# Altium schematic sheet communication.SchDoc
size A
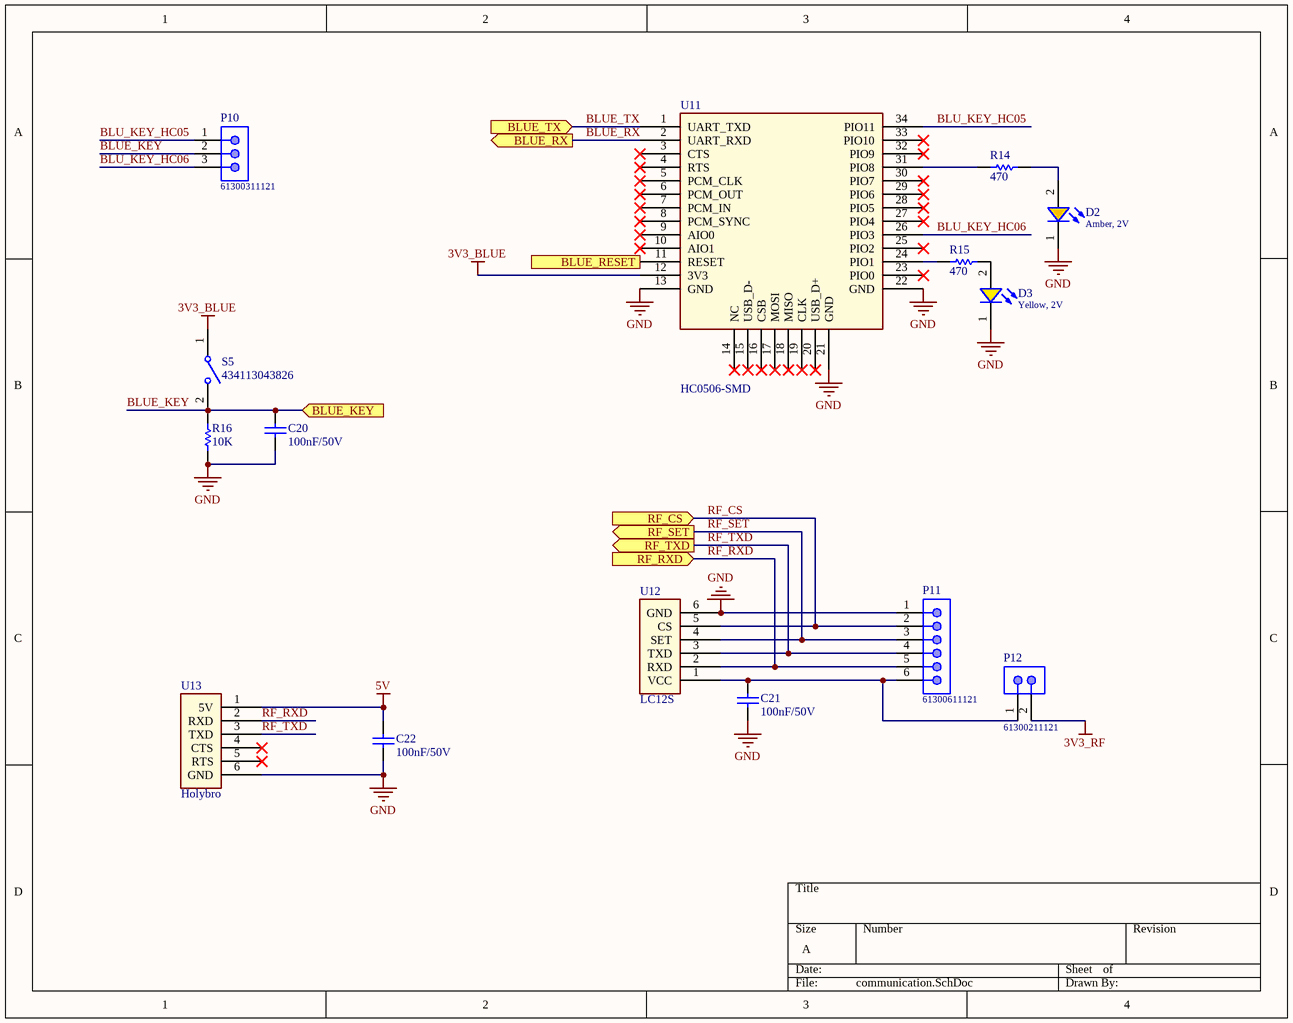
[diagram p0: communication.SchDoc]

## Parts
C20  value 100nF/50V  [CAP-SM-0805]  (hidden comment: Cap-100nF-50V-0805)
C21  value 100nF/50V  [CAP-SM-0805]  (hidden comment: Cap-100nF-50V-0805)
C22  value 100nF/50V  [CAP-SM-0805]  (hidden comment: Cap-100nF-50V-0805)
D2  Amber, 2V  [WL-SMCW_0805]
D3  Yellow, 2V  [WL-SMCW_0805]
P10  61300311121  [61300311121]
P11  61300611121  [61300611121]
P12  61300211121  [61300211121]
R14  value 470  [RES-SM-0805]  (hidden comment: Res-470-0805)
R15  value 470  [RES-SM-0805]  (hidden comment: Res-470-0805)
R16  value 10K  [RES-SM-0805]  (hidden comment: Res-10k-0805)
S5  434113043826  [434113043826]
U11  HC0506-SMD  [HC0506-SMD]
U12  LC12S  [LC12S]
U13  Holybro  [Holybro]

## Ports
BLUE_KEY (in), BLUE_RESET (in), BLUE_RX (out), BLUE_TX (in), RF_CS (in), RF_RXD (in), RF_SET (out), RF_TXD (out)

## Nets
3V3_BLUE: S5.1 U11.12(3V3)
3V3_RF: P12.2
5V: C22.2 U13.1(5V)
GND: C20.1 C21.1 C22.1 D2.1(K) D3.1(K) P11.1 R16.2 U11.13(GND) U11.21(GND) U11.22(GND) U12.6(GND) U13.6(GND)
BLU_KEY_HC05: P10.1 U11.34(PIO11)
BLU_KEY_HC06: P10.3 U11.26(PIO3)
BLUE_KEY: C20.2 P10.2 R16.1 S5.2 ; port BLUE_KEY
BLUE_RESET: U11.11(RESET) ; port BLUE_RESET
BLUE_RX: U11.2(UART_RXD) ; port BLUE_RX
BLUE_TX: U11.1(UART_TXD) ; port BLUE_TX
RF_CS: P11.2 U12.5(CS) ; port RF_CS
RF_RXD: P11.5 U12.2(RXD) U13.2(RXD) ; port RF_RXD
RF_SET: P11.3 U12.4(SET) ; port RF_SET
RF_TXD: P11.4 U12.3(TXD) U13.3(TXD) ; port RF_TXD
NetC21_2: C21.2 P11.6 P12.1 U12.1(VCC)
NetD2_2: D2.2(A) R14.2
NetD3_2: D3.2(A) R15.2
NetR14_1: R14.1 U11.31(PIO8)
NetR15_1: R15.1 U11.24(PIO1)

Not connected (* = marked no-connect by the designer): U11 3(CTS)* 4(RTS)* 5(PCM_CLK)* 6(PCM_OUT)* 7(PCM_IN)* 8(PCM_SYNC)* 9(AIO0)* 10(AIO1)* 14(NC)* 15(USB_D-)* 16(CSB)* 17(MOSI)* 18(MISO)* 19(CLK)* 20(USB_D+)* 23(PIO0)* 25(PIO2)* 27(PIO4)* 28(PIO5)* 29(PIO6)* 30(PIO7)* 32(PIO9)* 33(PIO10)*; U13 4(CTS)* 5(RTS)*

## Library data of the parts
C20-C22 = Cap-100nF-50V-0805: CAP CER 0.1UF 50V Y5V 0805; Manufacturer: Samsung Electro-Mechanics; Manufacturer Part Number: CL21F104ZBCNNNC; Local Supplier: thegioiic; Local Supplier Link: https://thegioiic.com/products/tu-100nf-0-1uf-50v-0805; Supplier 1: Digikey; Supplier 1 Part Number: 1276-1007-1-ND; Supplier 1 Link: https://www.digikey.com/product-detail/en/samsung-electro-mechanics/CL21F104ZBCNNNC/1276-1007-1-ND/3889093
D2 = 150080AS75000: WL-SMCW SMT Mono-color Chip LED Waterclear, size 0805, Amber, 2V, 140deg; Chip Technology: AlInGaP; Dominant Wavelength typ.: 605nm; Luminous Intensity typ.: 130mcd; Peak Wavelength typ.: 610nm; Viewing Angle: 140deg; ComponentLink1Description: Manufacturer; ComponentLink1URL: http://www.we-online.de; ComponentLink2URL: https://www.we-online.com/catalog/datasheet/150080AS75000.pdf; ComponentLink2Description: Datasheet; Forward Voltage typ.: 2V; Emitting Color: Amber; Mounting Technology: SMT; Operating Temperature: -40 to +85degC; Published Date: December 2019; Part Number: 150080AS75000; Packaging: Tape and Reel; Size: 0805; Publisher: Wurth Elektronik
D3 = 150080YS75000: WL-SMCW SMT Mono-color Chip LED Waterclear, size 0805, Yellow, 2V, 140deg; Chip Technology: AlInGaP; Dominant Wavelength typ.: 590nm; Luminous Intensity typ.: 120mcd; Peak Wavelength typ.: 595nm; Viewing Angle: 140deg; ComponentLink1Description: Manufacturer; ComponentLink1URL: http://www.we-online.de; ComponentLink2URL: https://www.we-online.com/catalog/datasheet/150080YS75000.pdf; ComponentLink2Description: Datasheet; Forward Voltage typ.: 2V; Emitting Color: Yellow; Mounting Technology: SMT; Operating Temperature: -40 to +85degC; Published Date: December 2019; Part Number: 150080YS75000; Packaging: Tape and Reel; Size: 0805; Publisher: Wurth Elektronik
P10 = 61300311121: WR-PHD Pin Header, THT, pitch 2.54mm, Single Row, Vertical, 3p; Manufacturer: Wurth Elektronik; Pin Number: 3; Rated Current: 3A; Working Voltage: 250VAC; Withstanding Voltage: 500VAC; Contact Resistance: 20mOhm; ComponentLink1Description: Manufacturer; ComponentLink1URL: http://www.we-online.de; ComponentLink2Description: Datasheet; ComponentLink2URL: https://www.we-online.com/catalog/datasheet/61300311121.pdf; Manufacturer Part Number: 61300311121; Published Date: May 2020; Pitch: 2.54mm; Operating Temperature: -40 to +105degC; Mounting Technology: THT; Packaging: Bag; Gender: Pin Header; Row Number: Single; Orientation: Vertical
P11 = 61300611121: WR-PHD Pin Header, THT, pitch 2.54mm, Single Row, Vertical, 6p; Manufacturer: Wurth Elektronik; Pin Number: 6; Rated Current: 3A; Working Voltage: 250VAC; Withstanding Voltage: 500VAC; Contact Resistance: 20mOhm; ComponentLink1Description: Manufacturer; ComponentLink1URL: http://www.we-online.de; ComponentLink2Description: Datasheet; ComponentLink2URL: https://www.we-online.com/catalog/datasheet/61300611121.pdf; Manufacturer Part Number: 61300611121; Published Date: May 2020; Pitch: 2.54mm; Operating Temperature: -40 to +105degC; Mounting Technology: THT; Packaging: Bag; Gender: Pin Header; Row Number: Single; Orientation: Vertical
P12 = 61300211121: WR-PHD Pin Header, THT, pitch 2.54mm, Single Row, Vertical, 2p; Manufacturer: Wurth Elektronik; Pin Number: 2; Rated Current: 3A; Working Voltage: 250VAC; Withstanding Voltage: 500VAC; Contact Resistance: 20mOhm; ComponentLink1Description: Manufacturer; ComponentLink1URL: http://www.we-online.de; ComponentLink2Description: Datasheet; ComponentLink2URL: https://www.we-online.com/catalog/datasheet/61300211121.pdf; Manufacturer Part Number: 61300211121; Published Date: May 2020; Pitch: 2.54mm; Operating Temperature: -40 to +105degC; Mounting Technology: THT; Packaging: Bag; Gender: Pin Header; Row Number: Single; Orientation: Vertical
R14 R15 = Res-470-0805: RES 470 OHM JUMPER 0805; Manufacturer: YAG6006CT-ND; Manufacturer Part Number: PE0805FRF7W0R047L; Local Supplier: thegioiic; Local Supplier Link: https://www.thegioiic.com/products/dien-tro-470-kohm-0805-5; Supplier 1: Digikey; Supplier 1 Link: https://www.digikey.com/product-detail/en/yageo/PE0805FRF7W0R047L/YAG6006CT-ND/9696460; Supplier 1 Part Number: YAG6006CT-ND
R16 = Res-10k-0805: RES 10K OHM 1% 1/4W 0805; Manufacturer: Stackpole Electronics Inc; Manufacturer Part Number: RNCP0805FTD10K0; Local Supplier: thegioiic; Local Supplier Link: https://thegioiic.com/products/dien-tro-10k-ohm-0805-5; Supplier 1: Digikey; Supplier 1 Link: https://www.digikey.com/product-detail/en/stackpole-electronics-inc/RNCP0805FTD10K0/RNCP0805FTD10K0CT-ND/2240601; Supplier 1 Part Number: RNCP0805FTD10K0CT-ND
S5 = 434113043826: WS-TASV J-Bend SMT Tact Switch 6x3.5mm, height 4.3mm, 260gf; Rated Voltage: 12VDC; Rated Current: 50mA; Washable: No; ComponentLink1Description: Manufacturer; ComponentLink1URL: http://www.we-online.de; ComponentLink2Description: Datasheet; ComponentLink2URL: https://katalog.we-online.com/em/datasheet/434113043826.pdf; Operating Temperature: -40 to +85degC; Part Number: 434113043826; Published Date: September 2019; Contact Material: Stainless Steel; Height: 4.3mm; Mounting Technology: SMT; Contact Plating: Silver; Operation Force: 260gf; Packaging: Tape and Reel; Terminal Material: Copper Alloy; Publisher: Wurth Elektronik; Terminal Plating: Silver
U11 = HC0506-SMD: Local Supplier: HShop; Local Supplier Part Name: HS000881; Local Supplier Link: https://hshop.vn/products/mach-thu-phat-bluetooth-hc-05-chua-ra-chon-master; Manufacturer: *; Manufacturer Part Name: *
U12 = LC12S: Local Supplier: HShop; Local Supplier Link: https://hshop.vn/products/mach-thu-phat-rf-uart-lc12s-2-4ghz; Local Supplier Part Number: HS000895; Manufacturer: *; Manufacturer Part Number: *
U13 = Holybro: Local Supplier: *; Local Supplier Link: *; Local Supplier Part Number: *; Manufacturer: *; Manufacturer Part Number: *